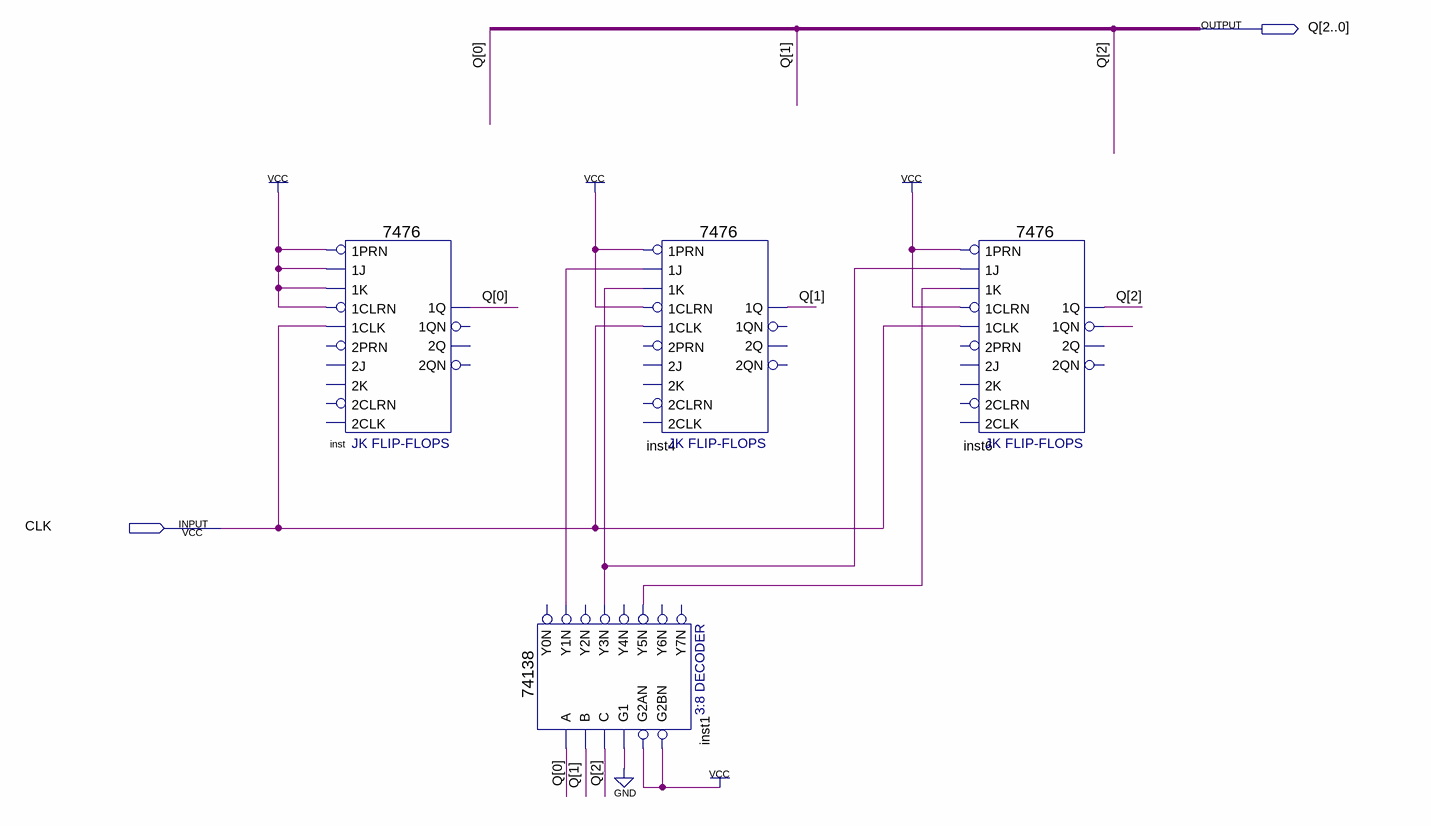
[diagram p0: schematic sheet]
// Quartus schematic SixCnt_decoder.bdf as structural Verilog: 4 symbols, 2 pins
module SixCnt_decoder (
  input  CLK,
  output [2:0] Q
);

  wire inst1_y1n, inst1_y3n, inst1_y5n, inst6_1qn;

  \7476  inst (
    .\1J (1'b1), .\1K (1'b1), .\1PRN (1'b1), .\1CLK (CLK), .\1CLRN (1'b1), .\1Q (Q[0]));  // open: 2PRN, 2J, 2K, 2CLRN, 2CLK, 2QN, 2Q, 1QN
  \74138  inst1 (
    .A(Q[0]), .B(Q[1]), .G1(1'b0), .C(Q[2]), .G2AN(1'b1), .G2BN(1'b1), .Y1N(inst1_y1n), .Y3N(inst1_y3n),
    .Y5N(inst1_y5n));  // open: Y0N, Y2N, Y4N, Y6N, Y7N
  \7476  inst4 (
    .\1J (inst1_y1n), .\1K (inst1_y3n), .\1PRN (1'b1), .\1CLK (CLK), .\1CLRN (1'b1), .\1Q (Q[1]));  // open: 2PRN, 2J, 2K, 2CLRN, 2CLK, 2QN, 2Q, 1QN
  \7476  inst6 (
    .\1J (inst1_y3n), .\1K (inst1_y5n), .\1PRN (1'b1), .\1CLK (CLK), .\1CLRN (1'b1), .\1Q (Q[2]),
    .\1QN (inst6_1qn));  // open: 2PRN, 2J, 2K, 2CLRN, 2CLK, 2QN, 2Q
endmodule
